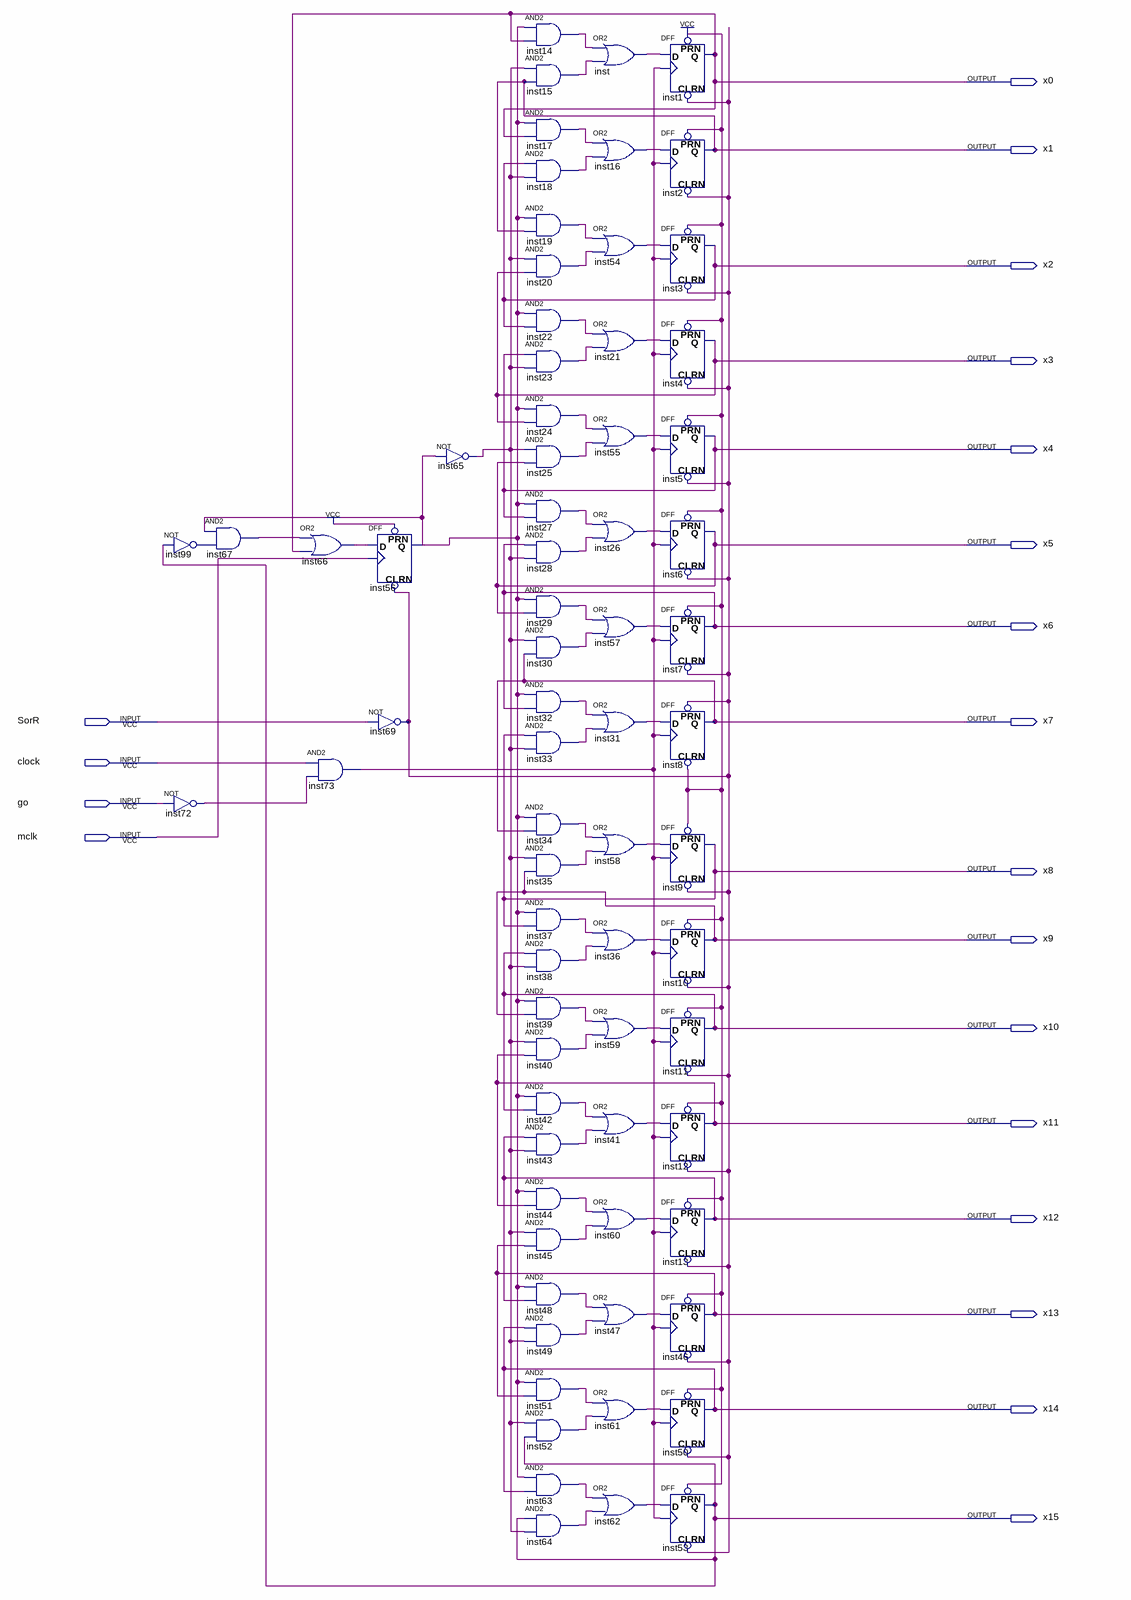
[diagram p0: schematic sheet]
// Quartus schematic xpos.bdf as structural Verilog: 72 symbols, 20 pins
module xpos (
  input  SorR,
  input  clock,
  input  go,
  input  mclk,
  output x0,
  output x1,
  output x2,
  output x3,
  output x4,
  output x5,
  output x6,
  output x7,
  output x8,
  output x9,
  output x10,
  output x11,
  output x12,
  output x13,
  output x14,
  output x15
);

  wire inst14_out, inst15_out, inst16_out, inst17_out, inst18_out, inst19_out, inst20_out, inst21_out,
       inst22_out, inst23_out, inst24_out, inst25_out, inst26_out, inst27_out, inst28_out, inst29_out,
       inst30_out, inst31_out, inst32_out, inst33_out, inst34_out, inst35_out, inst36_out, inst37_out,
       inst38_out, inst39_out, inst40_out, inst41_out, inst42_out, inst43_out, inst44_out, inst45_out,
       inst47_out, inst48_out, inst49_out, inst51_out, inst52_out, inst54_out, inst55_out, inst56_q,
       inst57_out, inst58_out, inst59_out, inst60_out, inst61_out, inst62_out, inst63_out, inst64_out,
       inst65_out, inst66_out, inst67_out, inst69_out, inst72_out, inst73_out, inst99_out, inst_out;

  and inst67 (inst67_out, inst56_q, inst99_out);
  not inst99 (inst99_out, x15);
  not inst72 (inst72_out, go);
  or inst66 (inst66_out, inst67_out, x0);
  and inst73 (inst73_out, clock, inst72_out);
  DFF inst56 (.CLRN(inst69_out), .CLK(mclk), .D(inst66_out), .PRN(1'b1), .Q(inst56_q));
  not inst69 (inst69_out, SorR);
  not inst65 (inst65_out, inst56_q);
  and inst14 (inst14_out, inst56_q, x0);
  and inst15 (inst15_out, inst65_out, x1);
  and inst17 (inst17_out, inst56_q, x0);
  and inst18 (inst18_out, x2, inst65_out);
  and inst19 (inst19_out, inst56_q, x1);
  and inst20 (inst20_out, inst65_out, x3);
  and inst22 (inst22_out, inst56_q, x2);
  and inst23 (inst23_out, x4, inst65_out);
  and inst24 (inst24_out, inst56_q, x3);
  and inst25 (inst25_out, inst65_out, x5);
  and inst27 (inst27_out, inst56_q, x4);
  and inst28 (inst28_out, x6, inst65_out);
  and inst29 (inst29_out, inst56_q, x5);
  and inst30 (inst30_out, inst65_out, x7);
  and inst32 (inst32_out, inst56_q, x6);
  and inst33 (inst33_out, x8, inst65_out);
  and inst34 (inst34_out, inst56_q, x7);
  and inst35 (inst35_out, inst65_out, x9);
  and inst37 (inst37_out, inst56_q, x8);
  and inst38 (inst38_out, x10, inst65_out);
  and inst39 (inst39_out, inst56_q, x9);
  and inst40 (inst40_out, inst65_out, x11);
  and inst42 (inst42_out, inst56_q, x10);
  and inst43 (inst43_out, x12, inst65_out);
  and inst44 (inst44_out, inst56_q, x11);
  and inst45 (inst45_out, inst65_out, x13);
  and inst48 (inst48_out, inst56_q, x12);
  and inst49 (inst49_out, x14, inst65_out);
  and inst51 (inst51_out, inst56_q, x13);
  and inst52 (inst52_out, inst65_out, x15);
  and inst63 (inst63_out, inst56_q, x14);
  and inst64 (inst64_out, x15, inst65_out);
  or inst (inst_out, inst14_out, inst15_out);
  or inst16 (inst16_out, inst17_out, inst18_out);
  or inst54 (inst54_out, inst19_out, inst20_out);
  or inst21 (inst21_out, inst22_out, inst23_out);
  or inst55 (inst55_out, inst24_out, inst25_out);
  or inst26 (inst26_out, inst27_out, inst28_out);
  or inst57 (inst57_out, inst29_out, inst30_out);
  or inst31 (inst31_out, inst32_out, inst33_out);
  or inst58 (inst58_out, inst34_out, inst35_out);
  or inst36 (inst36_out, inst37_out, inst38_out);
  or inst59 (inst59_out, inst39_out, inst40_out);
  or inst41 (inst41_out, inst42_out, inst43_out);
  or inst60 (inst60_out, inst44_out, inst45_out);
  or inst47 (inst47_out, inst48_out, inst49_out);
  or inst61 (inst61_out, inst51_out, inst52_out);
  or inst62 (inst62_out, inst63_out, inst64_out);
  DFF inst1 (.CLRN(inst69_out), .CLK(inst73_out), .D(inst_out), .PRN(1'b1), .Q(x0));
  DFF inst2 (.CLRN(inst69_out), .CLK(inst73_out), .D(inst16_out), .PRN(1'b1), .Q(x1));
  DFF inst3 (.CLRN(inst69_out), .CLK(inst73_out), .D(inst54_out), .PRN(1'b1), .Q(x2));
  DFF inst4 (.CLRN(inst69_out), .CLK(inst73_out), .D(inst21_out), .PRN(1'b1), .Q(x3));
  DFF inst5 (.CLRN(inst69_out), .CLK(inst73_out), .D(inst55_out), .PRN(1'b1), .Q(x4));
  DFF inst6 (.CLRN(inst69_out), .CLK(inst73_out), .D(inst26_out), .PRN(1'b1), .Q(x5));
  DFF inst7 (.CLRN(inst69_out), .CLK(inst73_out), .D(inst57_out), .PRN(1'b1), .Q(x6));
  DFF inst8 (.CLRN(1'b1), .CLK(inst73_out), .D(inst31_out), .PRN(inst69_out), .Q(x7));
  DFF inst9 (.CLRN(inst69_out), .CLK(inst73_out), .D(inst58_out), .PRN(1'b1), .Q(x8));
  DFF inst10 (.CLRN(inst69_out), .CLK(inst73_out), .D(inst36_out), .PRN(1'b1), .Q(x9));
  DFF inst11 (.CLRN(inst69_out), .CLK(inst73_out), .D(inst59_out), .PRN(1'b1), .Q(x10));
  DFF inst12 (.CLRN(inst69_out), .CLK(inst73_out), .D(inst41_out), .PRN(1'b1), .Q(x11));
  DFF inst13 (.CLRN(inst69_out), .CLK(inst73_out), .D(inst60_out), .PRN(1'b1), .Q(x12));
  DFF inst46 (.CLRN(inst69_out), .CLK(inst73_out), .D(inst47_out), .PRN(1'b1), .Q(x13));
  DFF inst50 (.CLRN(inst69_out), .CLK(inst73_out), .D(inst61_out), .PRN(1'b1), .Q(x14));
  DFF inst53 (.CLRN(inst69_out), .CLK(inst73_out), .D(inst62_out), .PRN(1'b1), .Q(x15));
endmodule
